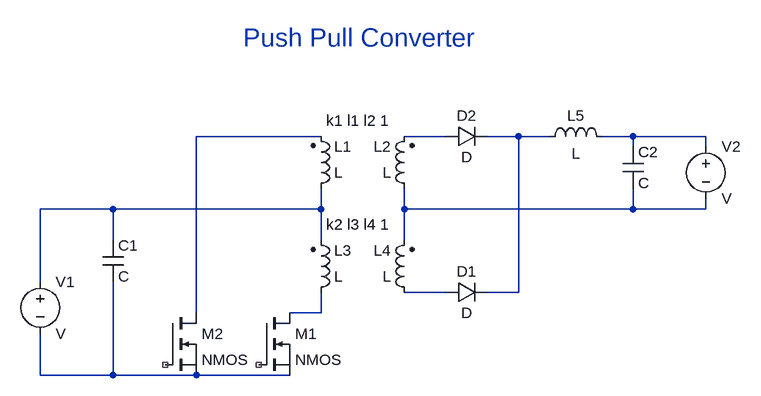
[diagram p0: schematic Push pull converter.asc]
Push pull converter.asc, the LTspice schematic file:
Version 4
SHEET 1 936 680
WIRE 240 48 48 48
WIRE 432 48 368 48
WIRE 544 48 496 48
WIRE 592 48 544 48
WIRE 720 48 672 48
WIRE 832 48 720 48
WIRE 720 64 720 48
WIRE 832 64 832 48
WIRE -80 160 -192 160
WIRE 240 160 240 128
WIRE 240 160 -80 160
WIRE 368 160 368 128
WIRE 720 160 720 128
WIRE 720 160 368 160
WIRE 832 160 832 144
WIRE 832 160 720 160
WIRE -80 208 -80 160
WIRE 240 208 240 160
WIRE 368 208 368 160
WIRE -192 272 -192 160
WIRE 432 288 368 288
WIRE 544 288 544 48
WIRE 544 288 496 288
WIRE 48 320 48 48
WIRE 240 320 240 288
WIRE 240 320 192 320
WIRE -192 416 -192 352
WIRE -80 416 -80 272
WIRE -80 416 -192 416
WIRE 48 416 -80 416
WIRE 192 416 48 416
SYMBOL ind2 224 144 M180
WINDOW 0 36 80 Left 2
WINDOW 3 36 40 Left 2
SYMATTR InstName L1
SYMBOL ind2 384 144 R180
WINDOW 0 36 80 Left 2
WINDOW 3 36 40 Left 2
SYMATTR InstName L2
SYMBOL ind2 224 304 M180
WINDOW 0 36 80 Left 2
WINDOW 3 36 40 Left 2
SYMATTR InstName L3
SYMBOL ind2 384 304 R180
WINDOW 0 36 80 Left 2
WINDOW 3 36 40 Left 2
SYMATTR InstName L4
SYMBOL nmos 144 320 R0
SYMATTR InstName M1
SYMBOL nmos 0 320 R0
SYMATTR InstName M2
SYMBOL cap -96 208 R0
SYMATTR InstName C1
SYMBOL diode 432 304 R270
WINDOW 0 32 32 VTop 2
WINDOW 3 0 32 VBottom 2
SYMATTR InstName D1
SYMBOL diode 432 64 R270
WINDOW 0 32 32 VTop 2
WINDOW 3 0 32 VBottom 2
SYMATTR InstName D2
SYMBOL ind 576 64 R270
WINDOW 0 32 56 VTop 2
WINDOW 3 5 56 VBottom 2
SYMATTR InstName L5
SYMBOL cap 704 64 R0
SYMATTR InstName C2
SYMBOL voltage -192 256 R0
SYMATTR InstName V1
SYMBOL voltage 832 48 R0
SYMATTR InstName V2
TEXT 248 24 Left 2 !k1 l1 l2 1
TEXT 248 184 Left 2 !k2 l3 l4 1
TEXT 120 -104 Left 4 ;Push Pull Converter

The netlist it stands for:
* Push pull converter.asc
L1 N005 N001 L
L2 N006 N002 L
L3 N008 N005 L
L4 N007 N006 L
M1 N008 NC_01 N009 N009 NMOS
M2 N001 NC_02 N009 N009 NMOS
C1 N005 N009 C
D1 N007 N003 D
D2 N002 N003 D
L5 N003 N004 L
C2 N004 N006 C
V1 N005 N009 V
V2 N004 N006 V
.model D D
.lib standard.dio
.model NMOS NMOS
.model PMOS PMOS
.lib standard.mos
k1 l1 l2 1
k2 l3 l4 1
* Push Pull Converter
.backanno
.end